# Altium schematic sheet encode and decode 1.SchDoc
size A4; SheetNumber: 3; SheetTotal: 5
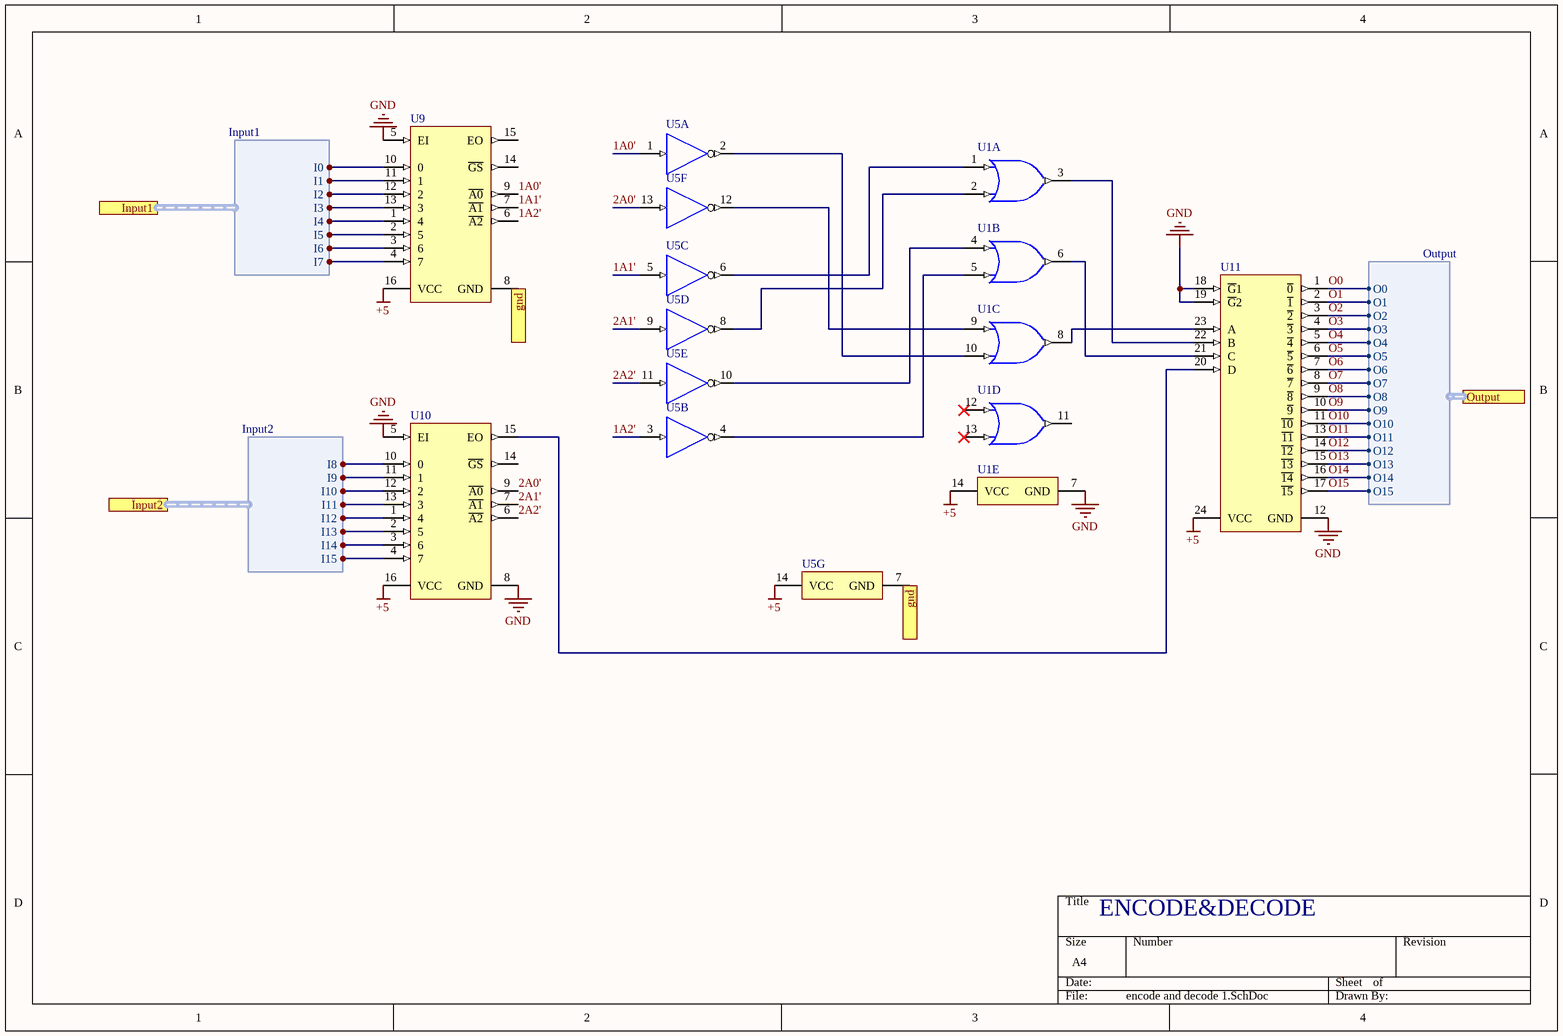
[diagram p0: encode and decode 1.SchDoc]

## Parts
U1  SN7432N  [N0014A]  (value not drawn)  (parts A,B,C,D,E of 5)
U5  SN74HCU04N  [N0014A]  (value not drawn)  (parts A,B,C,D,E,F,G of 7)
U9  SN74LS148N  [N0016A]  (value not drawn)
U10  SN74LS148N  [N0016A]  (value not drawn)
U11  SN74154N  [N0024A]  (value not drawn)

## Ports
gnd (in, see Top[2C], switch 1[3A]), Input1 (harness Input1, see Top[2D], switch 1[1B]), Input2 (harness Input2, see Top[2C], switch 1[2B]), Output (harness Output, see Top[2D], AND operations 1[1C])

## Harnesses
Output: O0, O1, O2, O3, O4, O5, O6, O7, O9, O8, O10, O11, O12, O13, O14, O15
Input1: I0, I1, I2, I3, I4, I5, I6, I7
Input2: I8, I9, I10, I11, I12, I13, I14, I15

## Nets
+5: U1.14(VCC) U5.14(VCC) U9.16(VCC) U10.16(VCC) U11.24(VCC)
GND: U1.7(GND) U9.5(EI) U10.5(EI) U10.8(GND) U11.12(GND) U11.18(~{G}1) U11.19(~{G}2)
1A0': U5.1(1A) U9.9(~{A0})
1A1': U5.5(3A) U9.7(~{A1})
1A2': U5.3(2A) U9.6(~{A2})
2A0': U5.13(6A) U10.9(~{A0})
2A1': U5.9(4A) U10.7(~{A1})
2A2': U5.11(5A) U10.6(~{A2})
gnd: U5.7(GND) U9.8(GND) ; port gnd  [a separate net that carries the same name]
O0: U11.1(~{0}) ; port Output.O0
O1: U11.2(~{1}) ; port Output.O1
O2: U11.3(~{2}) ; port Output.O2
O3: U11.4(~{3}) ; port Output.O3
O4: U11.5(~{4}) ; port Output.O4
O5: U11.6(~{5}) ; port Output.O5
O6: U11.7(~{6}) ; port Output.O6
O7: U11.8(~{7}) ; port Output.O7
O8: U11.9(~{8}) ; port Output.O8
O9: U11.10(~{9}) ; port Output.O9
O10: U11.11(~{10}) ; port Output.O10
O11: U11.13(~{11}) ; port Output.O11
O12: U11.14(~{12}) ; port Output.O12
O13: U11.15(~{13}) ; port Output.O13
O14: U11.16(~{14}) ; port Output.O14
O15: U11.17(~{15}) ; port Output.O15
NetU1_1: U1.1(1A) U5.6(~{3Y})
NetU1_2: U1.2(1B) U5.8(~{4Y})
NetU1_3: U1.3(1Y) U11.22(B)
NetU1_4: U1.4(2A) U5.10(~{5Y})
NetU1_5: U1.5(2B) U5.4(~{2Y})
NetU1_6: U1.6(2Y) U11.21(C)
NetU1_8: U1.8(3Y) U11.23(A)
NetU1_9: U1.9(3A) U5.12(~{6Y})
NetU1_10: U1.10(3B) U5.2(~{1Y})
NetU9_1: U9.1(4) ; port Input1.I4
NetU9_2: U9.2(5) ; port Input1.I5
NetU9_3: U9.3(6) ; port Input1.I6
NetU9_4: U9.4(7) ; port Input1.I7
NetU9_10: U9.10(0) ; port Input1.I0
NetU9_11: U9.11(1) ; port Input1.I1
NetU9_12: U9.12(2) ; port Input1.I2
NetU9_13: U9.13(3) ; port Input1.I3
NetU10_1: U10.1(4) ; port Input2.I12
NetU10_2: U10.2(5) ; port Input2.I13
NetU10_3: U10.3(6) ; port Input2.I14
NetU10_4: U10.4(7) ; port Input2.I15
NetU10_10: U10.10(0) ; port Input2.I8
NetU10_11: U10.11(1) ; port Input2.I9
NetU10_12: U10.12(2) ; port Input2.I10
NetU10_13: U10.13(3) ; port Input2.I11
NetU10_15: U10.15(EO) U11.20(D)

Not connected (* = marked no-connect by the designer): U1 11(4Y) 12(4A)* 13(4B)*; U9 14(~{GS}) 15(EO); U10 14(~{GS})

## Notes on the sheet
- ENCODE&DECODE

## Library data of the parts
U1 = CMP-1573-00140-3: Quad 2-input positive-OR gates, N0014A, TUBE; Manufacturer: Texas Instruments; Generic Part Number: SN7432; VCC(Max)(V): 5.25; Voltage(Nom)(V): 5; VCC(Min)(V): 4.75; F @ Nom Voltage(Max)(Mhz): 100; Output Type: TTL; Output Drive (IOL/IOH)(Max)(mA): 0.8/-16; ICC @ Nom Voltage(Max)(mA): 0.038; Bits(#): 4; tpd @ Nom Voltage(Max)(ns): 22; Rating: Catalog; PackageVersion: http://www.ti.com/lit/ml/mpdi002c/mpdi002c.pdf; Operating Temperature Range(C): 0 to 70; DatasheetVersion: SDLS100; Code_JEDEC: MS-001; Input Type: TTL; PackageReference: N0014A
U5 = CMP-1615-00910-2: Hex Inverters, N0014A, TUBE; Manufacturer: Texas Instruments; Technology Family: HC; Bits(#): 6; Schmitt Trigger: No; Output Drive (IOL/IOH)(Max)(mA): -4/4; Input Type: CMOS; F @ Nom Voltage(Max)(Mhz): 20; VCC(Min)(V): 2; Voltage(Nom)(V): 5; ICC @ Nom Voltage(Max)(mA): 0.02; Rating: Catalog; Operating Temperature Range(C): -40 to 85; Generic Part Number: SN74HCU04; VCC(Max)(V): 6; PackageReference: N0014A; tpd @ Nom Voltage(Max)(ns): 20; Output Type: CMOS; Code_JEDEC: MS-001; DatasheetVersion: SCLS079E
U9 U10 = CMP-1633-00673-2: 8-line to 3-line priority encoder, N0016A, TUBE; Manufacturer: Texas Instruments; Technology Family: LS; Channels(#): 1; Function: Encoder/Multiplexer; Schmitt Trigger: No; Output Drive (IOL/IOH)(Max)(mA): 8/-0.4; Bits(#): 8; Configuration: 8：3; Input Type: TTL; tpd @ Nom Voltage(Max)(ns): 19; VCC(Min)(V): 4.75; F @ Nom Voltage(Max)(Mhz): 35; ICC @ Nom Voltage(Max)(mA): 20; VCC(Max)(V): 5.25; Rating: Catalog; Voltage(Nom)(V): 5; Generic Part Number: SN74LS148; PackageReference: N0016A; Output Type: TTL; Operating Temperature Range(C): 0 to 70; Type: Standard; DatasheetVersion: SDLS053B; Code_JEDEC: MS-001
U11 = CMP-1633-00734-2: 4-Line To 16-Line Decoders/Demultiplexers, N0024A, TUBE; Manufacturer: Texas Instruments; Generic Part Number: SN74154; PackageReference: N0024A; Code_JEDEC: MS-011; DatasheetVersion: SDLS056